# EAGLE design extension.board (EAGLE 7.3.0)
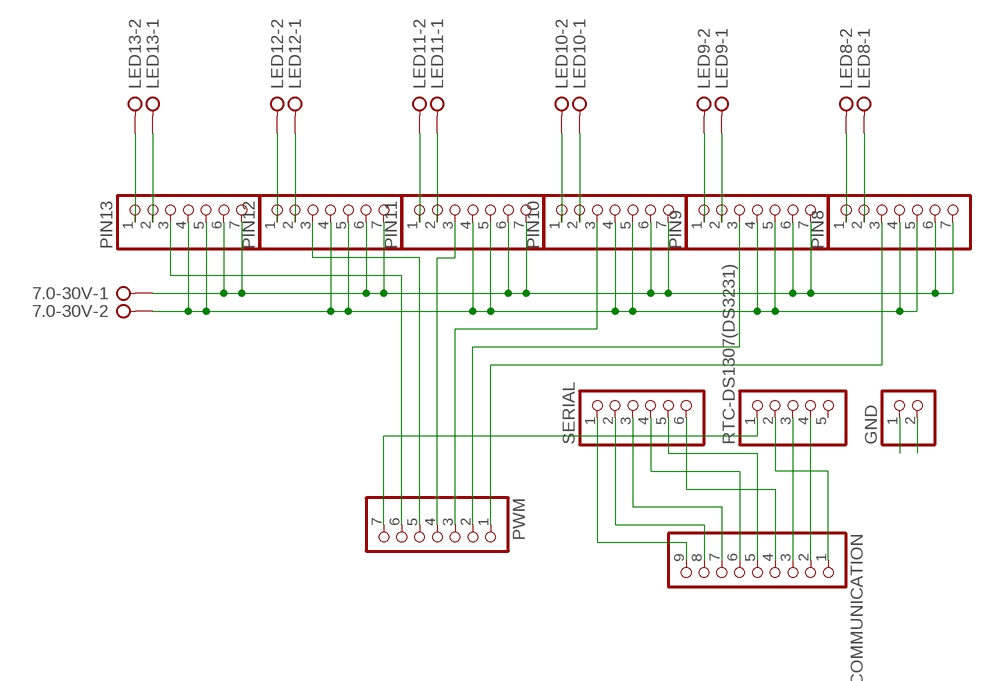
[diagram p0: schematic, sheet 1]

## Parts
7.0-30V  W237-02P  [W237-132]
COMMUNICATION  PINHD-1X9  [1X09]
GND  PINHD-1X2  [1X02]
LED8  W237-02P  [W237-132]
LED9  W237-02P  [W237-132]
LED10  W237-02P  [W237-132]
LED11  W237-02P  [W237-132]
LED12  W237-02P  [W237-132]
LED13  W237-02P  [W237-132]
PIN8  PINHD-1X7  [1X07]
PIN9  PINHD-1X7  [1X07]
PIN10  PINHD-1X7  [1X07]
PIN11  PINHD-1X7  [1X07]
PIN12  PINHD-1X7  [1X07]
PIN13  PINHD-1X7  [1X07]
PWM  PINHD-1X7  [1X07]
RTC-DS1307(DS3231)  PINHD-1X5  [1X05]
SERIAL  PINHD-1X6  [1X06]

## Nets
GND: 7.0-30V.2 GND.1 PIN8.4 PIN8.5 PIN9.4 PIN9.5 PIN10.4 PIN10.5 PIN11.4 PIN11.5 PIN12.4 PIN12.5 PIN13.4 PIN13.5 PWM.7 RTC-DS1307(DS3231).1
N$1: COMMUNICATION.2 RTC-DS1307(DS3231).4
N$2: COMMUNICATION.3 RTC-DS1307(DS3231).3
N$3: COMMUNICATION.4 SERIAL.6
N$4: COMMUNICATION.5 SERIAL.5
N$5: PIN8.3 PWM.1
N$6: PIN9.3 PWM.2
N$7: PIN10.3 PWM.3
N$8: PIN11.3 PWM.4
N$9: PIN12.3 PWM.5
N$10: PIN13.3 PWM.6
N$11: LED8.1 PIN8.2
N$12: LED8.2 PIN8.1
N$13: LED9.1 PIN9.2
N$14: LED9.2 PIN9.1
N$15: LED10.1 PIN10.2
N$16: LED10.2 PIN10.1
N$17: LED11.1 PIN11.2
N$18: LED11.2 PIN11.1
N$19: LED12.1 PIN12.2
N$20: LED12.2 PIN12.1
N$21: LED13.1 PIN13.2
N$22: LED13.2 PIN13.1
N$23: COMMUNICATION.6 SERIAL.4
N$24: COMMUNICATION.7 SERIAL.3
N$25: COMMUNICATION.8 SERIAL.2
N$26: COMMUNICATION.9 SERIAL.1
VCC: COMMUNICATION.1 GND.2 RTC-DS1307(DS3231).2
VCC12: 7.0-30V.1 PIN8.6 PIN8.7 PIN9.6 PIN9.7 PIN10.6 PIN10.7 PIN11.6 PIN11.7 PIN12.6 PIN12.7 PIN13.6 PIN13.7
Unconnected: RTC-DS1307(DS3231).5

## Library data of the parts
7.0-30V LED8-LED13 = con-wago-508:W237-02P: WAGO SREW CLAMP; OC_FARNELL: unknown; OC_NEWARK: unknown
COMMUNICATION = pinhead:PINHD-1X9: PIN HEADER
GND = pinhead:PINHD-1X2: PIN HEADER
PIN8-PIN13 PWM = pinhead:PINHD-1X7: PIN HEADER
RTC-DS1307(DS3231) = pinhead:PINHD-1X5: PIN HEADER
SERIAL = pinhead:PINHD-1X6: PIN HEADER

## Board
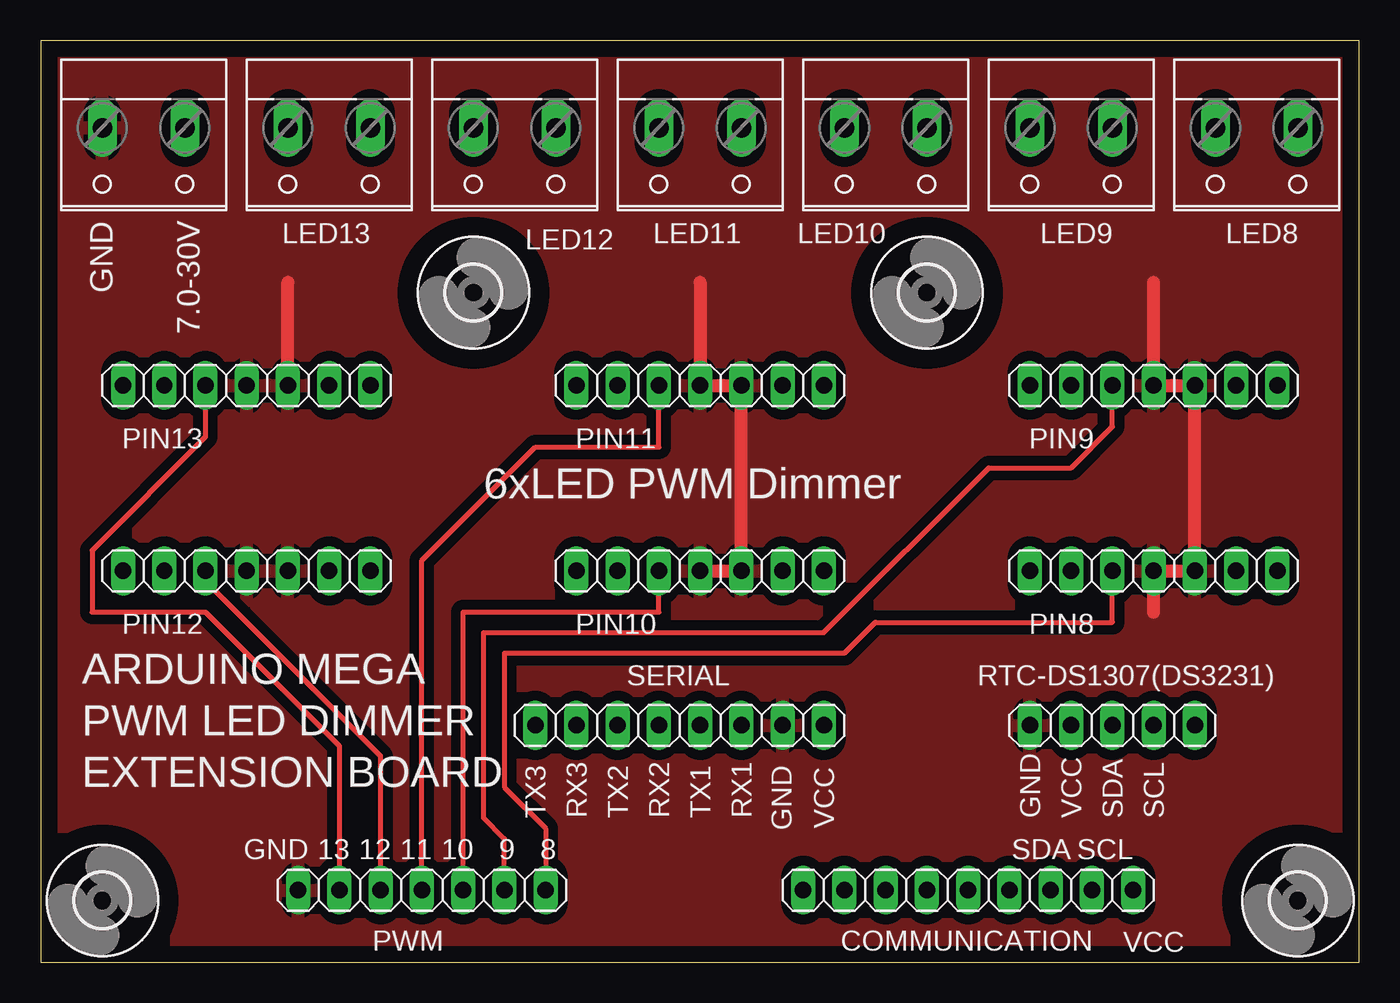
[diagram p1: board, top side]
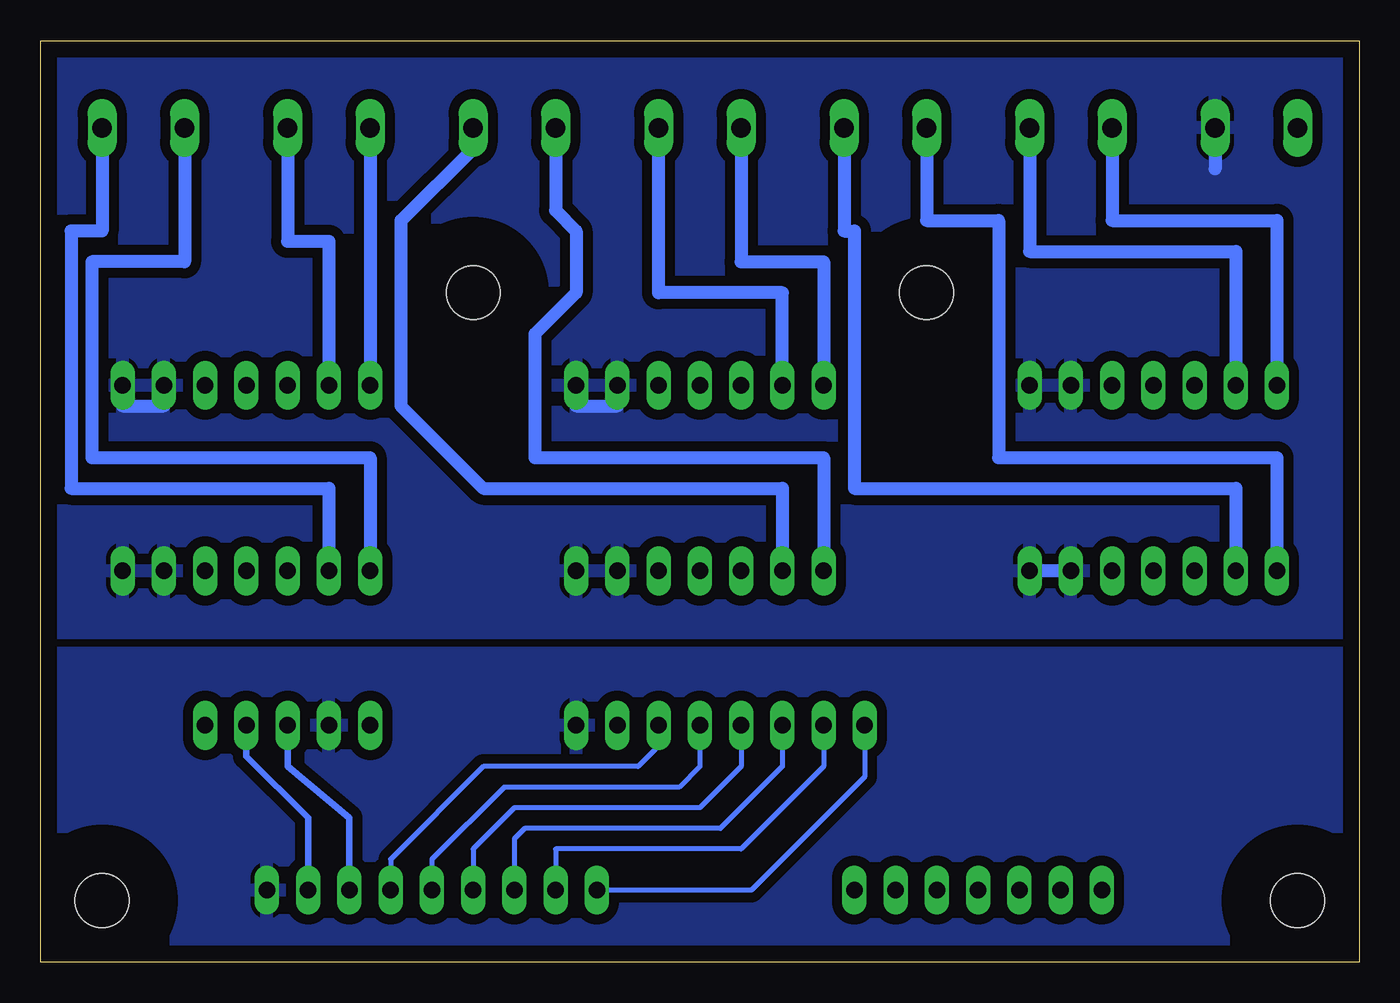
[diagram p2: board, bottom side, seen from below]

Size 81.26 x 56.82 mm. Coordinates in mm from the lower left corner, seen from the top.
Outline: 0,0 81.26,0 81.26,56.82 0,56.82 0,0
Copper layers (1*16): Top 0.035mm / dielectric 1.5mm / Bottom 0.035mm
Design rules "default": minimum track width 10mil, minimum drill 24mil, track to track 8mil, track to pad 8mil, pad to pad 8mil, via to via 8mil, smd to smd 8mil, copper to edge 40mil, drill to drill 8mil, minimum pad ring 10mil, minimum via ring 8mil, stop-mask expansion 4mil, vias tented up to drill 0mil, thermal gap 10mil

### Footprints (pad centres in the part's own frame; a part is rotated, then mirrored left to right if it is on the bottom)
W237-132 = drill 1.194 long: 1 -2.54,-0.635; 2 2.54,-0.635
1X09 = drill 1.016 long: 1 -10.16,0; 2 -7.62,0; 3 -5.08,0; 4 -2.54,0; 5 0,0; 6 2.54,0; 7 5.08,0; 8 7.62,0; 9 10.16,0
1X02 = drill 1.016 long: 1 -1.27,0; 2 1.27,0
1X07 = drill 1.016 long: 1 -7.62,0; 2 -5.08,0; 3 -2.54,0; 4 0,0; 5 2.54,0; 6 5.08,0; 7 7.62,0
1X05 = drill 1.016 long: 1 -5.08,0; 2 -2.54,0; 3 0,0; 4 2.54,0; 5 5.08,0
1X06 = drill 1.016 long: 1 -6.35,0; 2 -3.81,0; 3 -1.27,0; 4 1.27,0; 5 3.81,0; 6 6.35,0
3,3 = hole 3.3: 0,0

### Placement (x,y rotation side)
7.0-30V  6.35,50.8 180 top
COMMUNICATION  57.15,4.45 180 top
GND  46.99,14.61 0 top
LED8  74.93,50.8 180 top
LED9  63.5,50.8 180 top
LED10  52.07,50.8 180 top
LED11  40.64,50.8 180 top
LED12  29.21,50.8 180 top
LED13  17.78,50.8 180 top
PIN8  68.58,24.13 0 top
PIN9  68.58,35.56 0 top
PIN10  40.64,24.13 0 top
PIN11  40.64,35.56 0 top
PIN12  12.7,24.13 0 top
PIN13  12.7,35.56 0 top
PWM  23.5,4.45 180 top
RTC-DS1307(DS3231)  66.04,14.61 0 top
SERIAL  36.83,14.61 0 top
U$1  [3,3]  3.81,3.81 0 top
U$2  [3,3]  77.47,3.81 0 top
U$3  [3,3]  54.61,41.27 0 top
U$4  [3,3]  26.67,41.27 0 top

### Tracks (layer width: path | path; a pad name or v marks a point on that pad's centre or on a via)
GND
  Top 0.813: PIN13.5 15.24,41.91 | 40.64,41.91 PIN11.4 PIN11.5 PIN10.5 PIN10.4 | 68.58,41.91 PIN9.4 PIN9.5 PIN8.5 PIN8.4 68.58,21.59
  pour Top (isolate 0.61): 0,57.15 80.64,57.15 80.64,0 0,0
N$1
  Bottom 0.406: RTC-DS1307(DS3231).4 68.58,12.7 64.77,8.89 COMMUNICATION.2
N$2
  Bottom 0.406: RTC-DS1307(DS3231).3 66.04,12.06 62.23,8.89 COMMUNICATION.3
N$3
  Bottom 0.305: COMMUNICATION.4 59.69,6.35 53.98,12.06 44.45,12.06 43.18,13.34 SERIAL.6
N$4
  Bottom 0.305: SERIAL.5 40.64,12.06 41.91,10.79 52.71,10.79 57.15,6.35 COMMUNICATION.5
N$5
  Top 0.305: PIN8.3 66.04,20.95 51.44,20.95 49.53,19.05 28.57,19.05 28.57,10.79 31.11,8.26 PWM.1
N$6
  Top 0.305: PIN9.3 66.04,33.02 63.5,30.48 58.42,30.48 48.26,20.32 27.3,20.32 27.3,8.89 28.57,7.62 PWM.2
N$7
  Top 0.305: PWM.3 26.04,21.59 38.1,21.59 PIN10.3
N$8
  Top 0.305: PWM.4 23.5,24.77 30.48,31.75 38.1,31.75 PIN11.3
N$9
  Top 0.305: PWM.5 20.95,12.7 10.16,23.5 PIN12.3
N$10
  Top 0.305: PIN13.3 10.16,32.38 3.17,25.4 3.17,21.59 10.16,21.59 18.41,13.34 PWM.6
N$11
  Bottom 0.813: PIN8.2 63.5,29.21 79.38,29.21 79.38,45.09 77.47,45.09 LED8.1
N$12
  Bottom 0.813: PIN8.1 60.96,31.11 78.1,31.11 78.1,43.18 72.39,43.18 LED8.2
N$13
  Bottom 0.813: LED9.1 66.04,44.45 63.5,44.45 PIN9.2
N$14
  Bottom 0.813: LED9.2 PIN9.1
N$15
  Bottom 0.813: PIN10.2 35.56,29.21 53.98,29.21 59.05,34.29 59.05,45.72 54.61,50.16 LED10.1
N$16
  Bottom 0.813: PIN10.1 33.02,31.11 50.8,31.11 50.8,38.73 48.26,41.27 48.26,45.09 49.53,46.35 LED10.2
N$17
  Bottom 0.813: PIN11.2 35.56,41.27 43.18,41.27 LED11.1
N$18
  Bottom 0.813: LED11.2 38.1,43.18 33.02,43.18 PIN11.1
N$19
  Bottom 0.813: PIN12.2 7.62,29.21 31.11,29.21 31.11,45.09 31.75,45.09 LED12.1
N$20
  Bottom 0.813: PIN12.1 5.08,31.11 22.22,31.11 22.22,45.72 26.67,45.72 LED12.2
N$21
  Bottom 0.813: PIN13.2 7.62,43.81 20.32,43.81 LED13.1
N$22
  Bottom 0.813: PIN13.1 5.08,45.72 15.24,45.72 LED13.2
N$23
  Bottom 0.305: SERIAL.4 38.1,12.06 40.64,9.53 52.07,9.53 54.61,6.99 COMMUNICATION.6
N$24
  Bottom 0.305: SERIAL.3 35.56,12.06 39.37,8.26 51.44,8.26 52.07,7.62 COMMUNICATION.7
N$25
  Bottom 0.305: SERIAL.2 33.02,12.06 38.1,6.99 49.53,6.99 COMMUNICATION.8
N$26
  Bottom 0.305: SERIAL.1 30.48,11.43 37.47,4.45 COMMUNICATION.9
VCC
  pour Bottom (isolate 0.61): 0,19.05 80.64,19.05 80.64,0 0,0
VCC12
  Bottom 0.813: PIN12.6 PIN12.7 | PIN11.6 45.72,34.29 48.26,34.29 PIN11.7 | PIN9.6 73.66,34.29 76.2,34.29 PIN9.7 | 7.0-30V.1 8.89,48.9
  pour Bottom (isolate 0.61): 0,56.52 80.64,56.52 80.64,20.32 0,20.32

### Text on the board
tNames: GND | 6xLED PWM Dimmer | ARDUINO MEGA | PWM LED DIMMER | EXTENSION BOARD | TX3 | RX3 | TX2 | RX2 | TX1 | RX1 | GND | VCC | SDA | SCL | GND | 13 | 12 | 11 | 10 | 9 | 8 | VCC | SDA | SCL | VCC